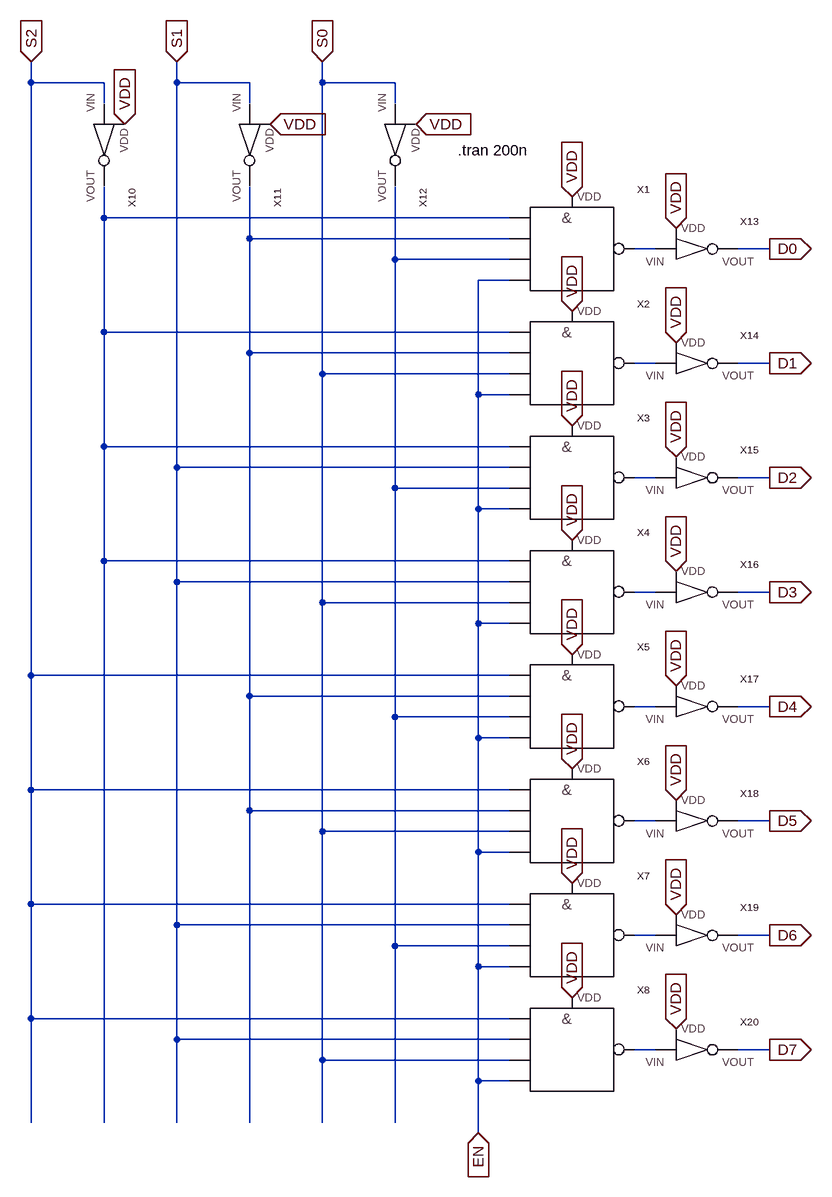
[diagram p0: schematic decoder.asc]
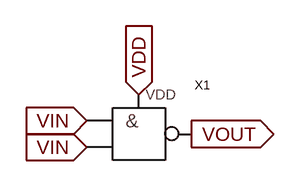
[diagram p1: sub-circuit inverter_2.asc]
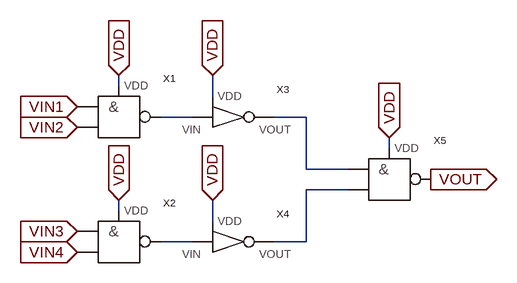
[diagram p2: sub-circuit nand_4.asc]
decoder.asc, the LTspice schematic file:
Version 4
SHEET 1 1684 1836
WIRE 272 128 272 96
WIRE 384 128 272 128
WIRE 496 128 496 96
WIRE 608 128 496 128
WIRE 720 128 720 96
WIRE 832 128 720 128
WIRE 384 160 384 128
WIRE 608 160 608 128
WIRE 832 160 832 128
WIRE 384 336 384 288
WIRE 1008 336 384 336
WIRE 608 368 608 288
WIRE 1008 368 608 368
WIRE 1232 384 1200 384
WIRE 1408 384 1360 384
WIRE 832 400 832 288
WIRE 1008 400 832 400
WIRE 1008 432 960 432
WIRE 384 512 384 336
WIRE 1008 512 384 512
WIRE 608 544 608 368
WIRE 1008 544 608 544
WIRE 1232 560 1200 560
WIRE 1408 560 1360 560
WIRE 720 576 720 128
WIRE 1008 576 720 576
WIRE 960 608 960 432
WIRE 1008 608 960 608
WIRE 384 688 384 512
WIRE 1008 688 384 688
WIRE 496 720 496 128
WIRE 1008 720 496 720
WIRE 1232 736 1200 736
WIRE 1408 736 1360 736
WIRE 832 752 832 400
WIRE 1008 752 832 752
WIRE 960 784 960 608
WIRE 1008 784 960 784
WIRE 384 864 384 688
WIRE 1008 864 384 864
WIRE 496 896 496 720
WIRE 1008 896 496 896
WIRE 1232 912 1200 912
WIRE 1408 912 1360 912
WIRE 720 928 720 576
WIRE 1008 928 720 928
WIRE 960 960 960 784
WIRE 1008 960 960 960
WIRE 272 1040 272 128
WIRE 1008 1040 272 1040
WIRE 608 1072 608 544
WIRE 1008 1072 608 1072
WIRE 1232 1088 1200 1088
WIRE 1408 1088 1360 1088
WIRE 832 1104 832 752
WIRE 1008 1104 832 1104
WIRE 960 1136 960 960
WIRE 1008 1136 960 1136
WIRE 272 1216 272 1040
WIRE 1008 1216 272 1216
WIRE 608 1248 608 1072
WIRE 1008 1248 608 1248
WIRE 1232 1264 1200 1264
WIRE 1408 1264 1360 1264
WIRE 720 1280 720 928
WIRE 1008 1280 720 1280
WIRE 960 1312 960 1136
WIRE 1008 1312 960 1312
WIRE 272 1392 272 1216
WIRE 1008 1392 272 1392
WIRE 496 1424 496 896
WIRE 1008 1424 496 1424
WIRE 1232 1440 1200 1440
WIRE 1408 1440 1360 1440
WIRE 832 1456 832 1104
WIRE 1008 1456 832 1456
WIRE 960 1488 960 1312
WIRE 1008 1488 960 1488
WIRE 272 1568 272 1392
WIRE 1008 1568 272 1568
WIRE 496 1600 496 1424
WIRE 1008 1600 496 1600
WIRE 1232 1616 1200 1616
WIRE 1408 1616 1360 1616
WIRE 720 1632 720 1280
WIRE 1008 1632 720 1632
WIRE 960 1664 960 1488
WIRE 1008 1664 960 1664
WIRE 272 1728 272 1568
WIRE 384 1728 384 864
WIRE 496 1728 496 1600
WIRE 608 1728 608 1248
WIRE 720 1728 720 1632
WIRE 832 1728 832 1456
WIRE 960 1744 960 1664
FLAG 272 96 S2
IOPIN 272 96 In
FLAG 496 96 S1
IOPIN 496 96 In
FLAG 720 96 S0
IOPIN 720 96 In
FLAG 1408 384 D0
IOPIN 1408 384 Out
FLAG 1408 560 D1
IOPIN 1408 560 Out
FLAG 1408 736 D2
IOPIN 1408 736 Out
FLAG 1408 912 D3
IOPIN 1408 912 Out
FLAG 1408 1088 D4
IOPIN 1408 1088 Out
FLAG 1408 1264 D5
IOPIN 1408 1264 Out
FLAG 1408 1440 D6
IOPIN 1408 1440 Out
FLAG 1408 1616 D7
IOPIN 1408 1616 Out
FLAG 416 192 VDD
IOPIN 416 192 In
FLAG 640 192 VDD
IOPIN 640 192 In
FLAG 864 192 VDD
IOPIN 864 192 In
FLAG 1104 304 VDD
IOPIN 1104 304 In
FLAG 1104 480 VDD
IOPIN 1104 480 In
FLAG 1104 656 VDD
IOPIN 1104 656 In
FLAG 1104 832 VDD
IOPIN 1104 832 In
FLAG 1104 1008 VDD
IOPIN 1104 1008 In
FLAG 1104 1184 VDD
IOPIN 1104 1184 In
FLAG 1104 1360 VDD
IOPIN 1104 1360 In
FLAG 1104 1536 VDD
IOPIN 1104 1536 In
FLAG 960 1744 EN
IOPIN 960 1744 In
FLAG 1264 352 VDD
IOPIN 1264 352 In
FLAG 1264 528 VDD
IOPIN 1264 528 In
FLAG 1264 704 VDD
IOPIN 1264 704 In
FLAG 1264 880 VDD
IOPIN 1264 880 In
FLAG 1264 1056 VDD
IOPIN 1264 1056 In
FLAG 1264 1232 VDD
IOPIN 1264 1232 In
FLAG 1264 1408 VDD
IOPIN 1264 1408 In
FLAG 1264 1584 VDD
IOPIN 1264 1584 In
SYMBOL inverter_2 384 144 R90
SYMATTR InstName X10
SYMBOL inverter_2 608 144 R90
SYMATTR InstName X11
SYMBOL inverter_2 832 144 R90
SYMATTR InstName X12
SYMBOL nand_4 1072 352 R0
SYMATTR InstName X1
SYMBOL nand_4 1072 528 R0
SYMATTR InstName X2
SYMBOL nand_4 1072 704 R0
SYMATTR InstName X3
SYMBOL nand_4 1072 880 R0
SYMATTR InstName X4
SYMBOL nand_4 1072 1056 R0
SYMATTR InstName X5
SYMBOL nand_4 1072 1232 R0
SYMATTR InstName X6
SYMBOL nand_4 1072 1408 R0
SYMATTR InstName X7
SYMBOL nand_4 1072 1584 R0
SYMATTR InstName X8
SYMBOL inverter_2 1216 384 R0
SYMATTR InstName X13
SYMBOL inverter_2 1216 560 R0
SYMATTR InstName X14
SYMBOL inverter_2 1216 736 R0
SYMATTR InstName X15
SYMBOL inverter_2 1216 912 R0
SYMATTR InstName X16
SYMBOL inverter_2 1216 1088 R0
SYMATTR InstName X17
SYMBOL inverter_2 1216 1264 R0
SYMATTR InstName X18
SYMBOL inverter_2 1216 1440 R0
SYMATTR InstName X19
SYMBOL inverter_2 1216 1616 R0
SYMATTR InstName X20
TEXT 928 232 Left 2 !.tran 200n

inverter_2.asc, the sub-circuit schematic file:
Version 4
SHEET 1 880 680
FLAG 16 48 VIN
IOPIN 16 48 In
FLAG 16 80 VIN
IOPIN 16 80 In
FLAG 80 16 VDD
IOPIN 80 16 In
FLAG 144 64 VOUT
IOPIN 144 64 Out
SYMBOL nand_2 80 64 R0
SYMATTR InstName X1

nand_4.asc, the sub-circuit schematic file:
Version 4
SHEET 1 1884 788
WIRE 544 224 544 208
WIRE 688 240 688 208
WIRE 656 272 608 272
WIRE 832 272 784 272
WIRE 960 320 960 304
WIRE 832 352 832 272
WIRE 896 352 832 352
WIRE 896 384 832 384
WIRE 544 416 544 400
WIRE 688 432 688 400
WIRE 656 464 608 464
WIRE 832 464 832 384
WIRE 832 464 784 464
FLAG 480 256 VIN1
IOPIN 480 256 In
FLAG 480 288 VIN2
IOPIN 480 288 In
FLAG 544 208 VDD
IOPIN 544 208 In
FLAG 688 208 VDD
IOPIN 688 208 In
FLAG 480 448 VIN3
IOPIN 480 448 In
FLAG 480 480 VIN4
IOPIN 480 480 In
FLAG 544 400 VDD
IOPIN 544 400 In
FLAG 688 400 VDD
IOPIN 688 400 In
FLAG 960 304 VDD
IOPIN 960 304 In
FLAG 1024 368 VOUT
IOPIN 1024 368 Out
SYMBOL nand_2 544 272 R0
SYMATTR InstName X1
SYMBOL inverter_2 640 272 R0
SYMATTR InstName X3
SYMBOL nand_2 544 464 R0
SYMATTR InstName X2
SYMBOL inverter_2 640 464 R0
SYMATTR InstName X4
SYMBOL nand_2 960 368 R0
SYMATTR InstName X5

The netlist it stands for:
* decoder.asc
XX10 S2 VDD N001 inverter_2
XX11 S1 VDD N002 inverter_2
XX12 S0 VDD N004 inverter_2
XX1 N001 N002 N004 EN VDD N003 nand_4
XX2 N001 N002 S0 EN VDD N005 nand_4
XX3 N001 S1 N004 EN VDD N006 nand_4
XX4 N001 S1 S0 EN VDD N007 nand_4
XX5 S2 N002 N004 EN VDD N008 nand_4
XX6 S2 N002 S0 EN VDD N009 nand_4
XX7 S2 S1 N004 EN VDD N010 nand_4
XX8 S2 S1 S0 EN VDD N011 nand_4
XX13 N003 VDD D0 inverter_2
XX14 N005 VDD D1 inverter_2
XX15 N006 VDD D2 inverter_2
XX16 N007 VDD D3 inverter_2
XX17 N008 VDD D4 inverter_2
XX18 N009 VDD D5 inverter_2
XX19 N010 VDD D6 inverter_2
XX20 N011 VDD D7 inverter_2

* block symbol definitions
.subckt inverter_2 VIN VDD VOUT
XX1 VIN VIN VDD VOUT nand_2  ; pins VIN1 VIN2 VDD VOUT
.ends inverter_2

.subckt nand_4 VIN1 VIN2 VIN3 VIN4 VDD VOUT
XX1 VIN1 VIN2 VDD N001 nand_2  ; pins VIN1 VIN2 VDD VOUT
XX3 N001 VDD N002 inverter_2
XX2 VIN3 VIN4 VDD N004 nand_2  ; pins VIN1 VIN2 VDD VOUT
XX4 N004 VDD N003 inverter_2
XX5 N002 N003 VDD VOUT nand_2  ; pins VIN1 VIN2 VDD VOUT
.ends nand_4

.tran 200n
.backanno
.end